# Altium schematic sheet SH12 - RGMII Ethernet.SchDoc
size B; Organization: Altium Limited; Address1: L3, 12a Rodborough Rd; Address2: Frenchs Forest; Address3: NSW; Address4: Australia 2086
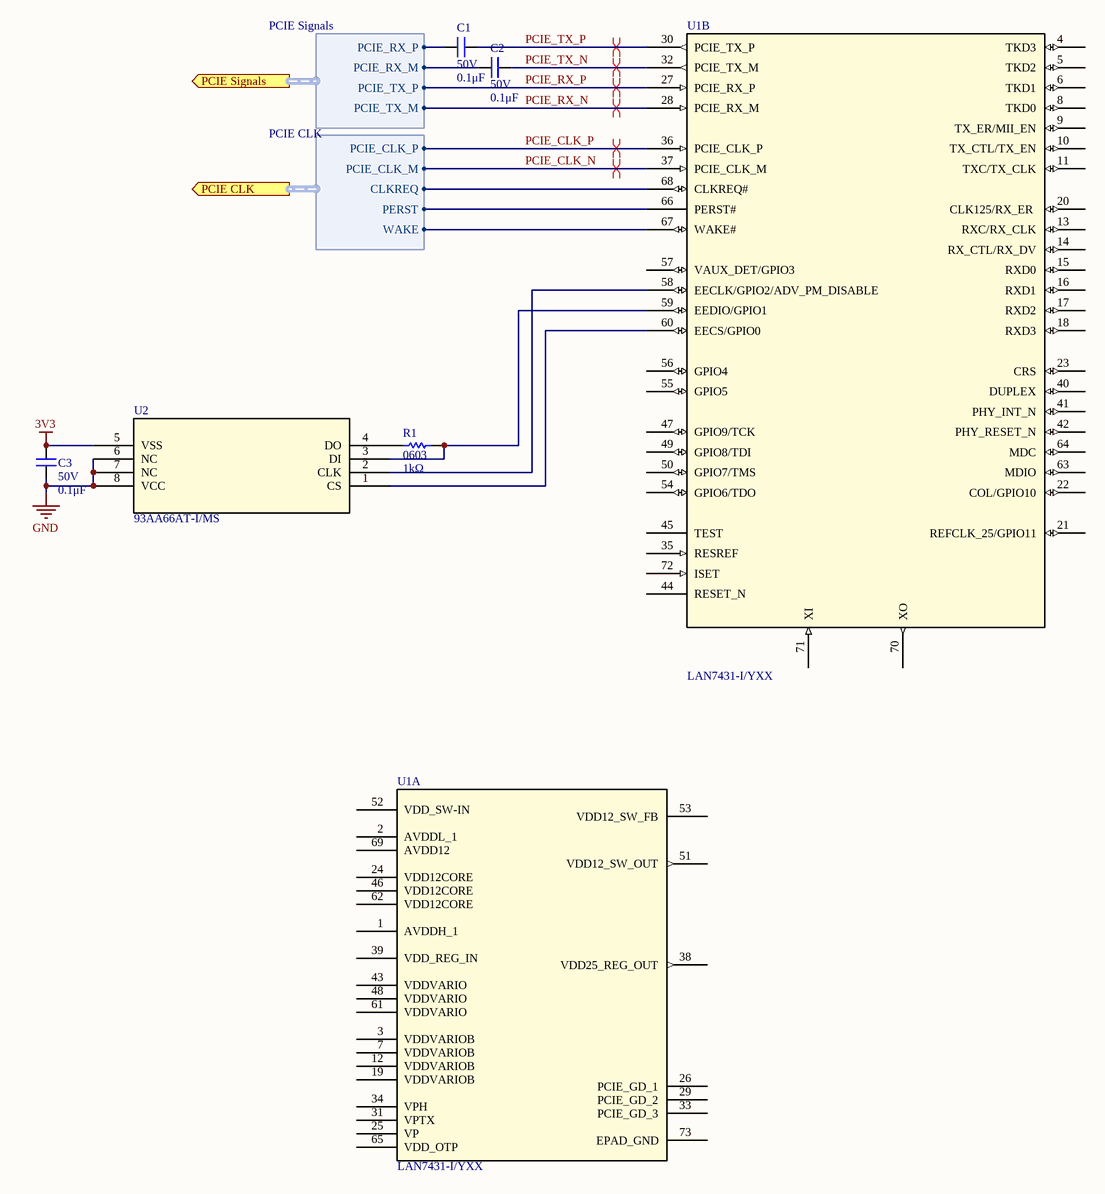
[diagram p0: SH12 - RGMII Ethernet.SchDoc]

## Parts
C1  value 0.1μF  Voltage Rating: 50V  [CAP0603]  (hidden comment: CAP_0.1uF_50V_0603)
C2  value 0.1μF  Voltage Rating: 50V  [CAP0603]  (hidden comment: CAP_0.1uF_50V_0603)
C3  value 0.1μF  Voltage Rating: 50V  [CAP0603]  (hidden comment: CAP_0.1uF_50V_0603)
R1  value 1kΩ  Package/Footprint: 0603  [RES0603]  (hidden comment: RES_1kΩ_0603_5%)
U1  LAN7431-I/YXX  (parts A,B of 2)
U2  93AA66AT-I/MS  [MSOP8_MC_MCH]

## Ports
PCIE CLK (out, harness PCIE CLK), PCIE Signals (out, harness PCIE Signals)

## Harnesses
PCIE Signals: PCIE_RX_P, PCIE_RX_M, PCIE_TX_P, PCIE_TX_M
PCIE CLK: PCIE_CLK_P, PCIE_CLK_M, CLKREQ, PERST, WAKE

## Nets
3V3: C3.2 U2.5(VSS)
GND: C3.1 U2.6(NC) U2.7(NC) U2.8(VCC)
PCIE_CLK_N: U1.37(PCIE_CLK_M) ; port PCIE CLK.PCIE_CLK_M
PCIE_CLK_P: U1.36(PCIE_CLK_P) ; port PCIE CLK.PCIE_CLK_P
PCIE_RX_N: U1.28(PCIE_RX_M) ; port PCIE Signals.PCIE_TX_M
PCIE_RX_P: U1.27(PCIE_RX_P) ; port PCIE Signals.PCIE_TX_P
PCIE_TX_N: C2.2 U1.32(PCIE_TX_M)
PCIE_TX_P: C1.2 U1.30(PCIE_TX_P)
NetC1_1: C1.1 ; port PCIE Signals.PCIE_RX_P
NetC2_1: C2.1 ; port PCIE Signals.PCIE_RX_M
NetR1_1: R1.1 U2.4(DO)
NetR1_2: R1.2 U1.59(EEDIO/GPIO1) U2.3(DI)
NetU1_58: U1.58(EECLK/GPIO2/ADV_PM_DISABLE) U2.2(CLK)
NetU1_60: U1.60(EECS/GPIO0) U2.1(CS)
NetU1_66: U1.66(PERST#) ; port PCIE CLK.PERST
NetU1_67: U1.67(WAKE#) ; port PCIE CLK.WAKE
NetU1_68: U1.68(CLKREQ#) ; port PCIE CLK.CLKREQ

Not connected (* = marked no-connect by the designer): U1 1(AVDDH_1) 2(AVDDL_1) 3(VDDVARIOB) 4(TKD3) 5(TKD2) 6(TKD1) 7(VDDVARIOB) 8(TKD0) 9(TX_ER/MII_EN) 10(TX_CTL/TX_EN) 11(TXC/TX_CLK) 12(VDDVARIOB) 13(RXC/RX_CLK) 14(RX_CTL/RX_DV) 15(RXD0) 16(RXD1) 17(RXD2) 18(RXD3) 19(VDDVARIOB) 20(CLK125/RX_ER_) 21(REFCLK_25/GPIO11) 22(COL/GPIO10) 23(CRS) 24(VDD12CORE) 25(VP) 26(PCIE_GD_1) 29(PCIE_GD_2) 31(VPTX) 33(PCIE_GD_3) 34(VPH) 35(RESREF) 38(VDD25_REG_OUT) 39(VDD_REG_IN) 40(DUPLEX) 41(PHY_INT_N) 42(PHY_RESET_N) 43(VDDVARIO) 44(RESET_N) 45(TEST) 46(VDD12CORE) 47(GPIO9/TCK) 48(VDDVARIO) 49(GPIO8/TDI) 50(GPIO7/TMS) 51(VDD12_SW_OUT) 52(VDD_SW-IN) 53(VDD12_SW_FB) 54(GPIO6/TDO) 55(GPIO5) 56(GPIO4) 57(VAUX_DET/GPIO3) 61(VDDVARIO) 62(VDD12CORE) 63(MDIO) 64(MDC) 65(VDD_OTP) 69(AVDD12) 70(XO) 71(XI) 72(ISET) 73(EPAD_GND)

## Layout directives
differential pair: PCIE_CLK_N, PCIE_CLK_P, PCIE_RX_N, PCIE_RX_P, PCIE_TX_N, PCIE_TX_P

## Notes on the sheet
- Title
- Size:
- Date:
- B
- Number:
- Time:
- Revision:
- Sheet
- of
- File:

## Library data of the parts
C1-C3 = CAP_0.1uF_50V_0603: CAP CER 0.1UF 50V X7R 0603; Manufacturer Part Number 1: CC0603KRX7R9BB104; Manufacturer 1: Yageo; Package/Footprint: 0603; Supplier Part Number 1: 311-1344-1-ND; Supplier 1: Digi-Key; Mounting Type: SMD; Dielectric: X7R
R1 = RES_1kΩ_0603_5%: RES 1K OHM 5% 1/10W 0603; Manufacturer 1: Yageo; Manufacturer Part Number 1: RC0603JR-071KL; Supplier Part Number 1: 311-1.0KGRCT-ND; Supplier 1: Digi-Key; Mounting Type: SMD
U1 = LAN7431-I/YXX: Serial I/O Controller, 4 Channel(s), 256MBps, CMOS; Manufacturer: Microchip; Max Frequency: 25MHz; Max Supply Voltage: 1.32V; Min Supply Voltage: 1.14V; Supply Voltage-Nom: 1.2V; Supplier 1: Digi-Key; Supplier Part Number 1: LAN7431-I/YXX-ND; Manufacturer Part Number: LAN7431-I/YXX; RoHS: No; Pricing 1: 168=5.64202 (USD); Package Code: HVQCCN; Number of Pins: 72; Package Shape: Square; Min Operating Temperature: -40°C; Max Operating Temperature: 85°C; Package Style: CHIP CARRIER, HEAT SINK/SLUG, VERY THIN PROFILEMeter; Surface Mount: Yes; Technology: CMOS; Terminal Form: No Lead; Terminal Position: QUAD; Length: 10mm; Width: 10mm; Height - Seated (Max): 1mm; Terminal Pitch: 0.5mm; Temperature Grade: INDUSTRIAL; REACH SVHC: Yes; RoHS Compliant: No; ComponentLink1URL: https://datasheet.ciiva.com:443/pdfs/VipMasterIC/IC/MCHP/MCHP-S-A0006921893/MCHP-S-A0006921893-1.pdf?src-supplier=IHS+Markit; ComponentLink1Description: https://datasheet.ciiva.com:443/pdfs/VipMasterIC/IC/MCHP/MCHP-S-A0006921893/MCHP-S-A0006921893-1.pdf?src-supplier=IHS+Markit
U2 = 93AA66AT-I/MS: No Description Available; Vendor: Microchip; Built_By: EMA_UL_Team; SourceLibrary: Microchip_2014-06-20; Manufacturer_Part_Number: 93AA66AT-I/MS; Copyright: Copyright (C) 2018 Accelerated Designs. All rights reserved; RefDes: RefDes; Type: DEV